# EAGLE design RPi-Breadboard_Bplus_v10 (EAGLE 7.5.0)
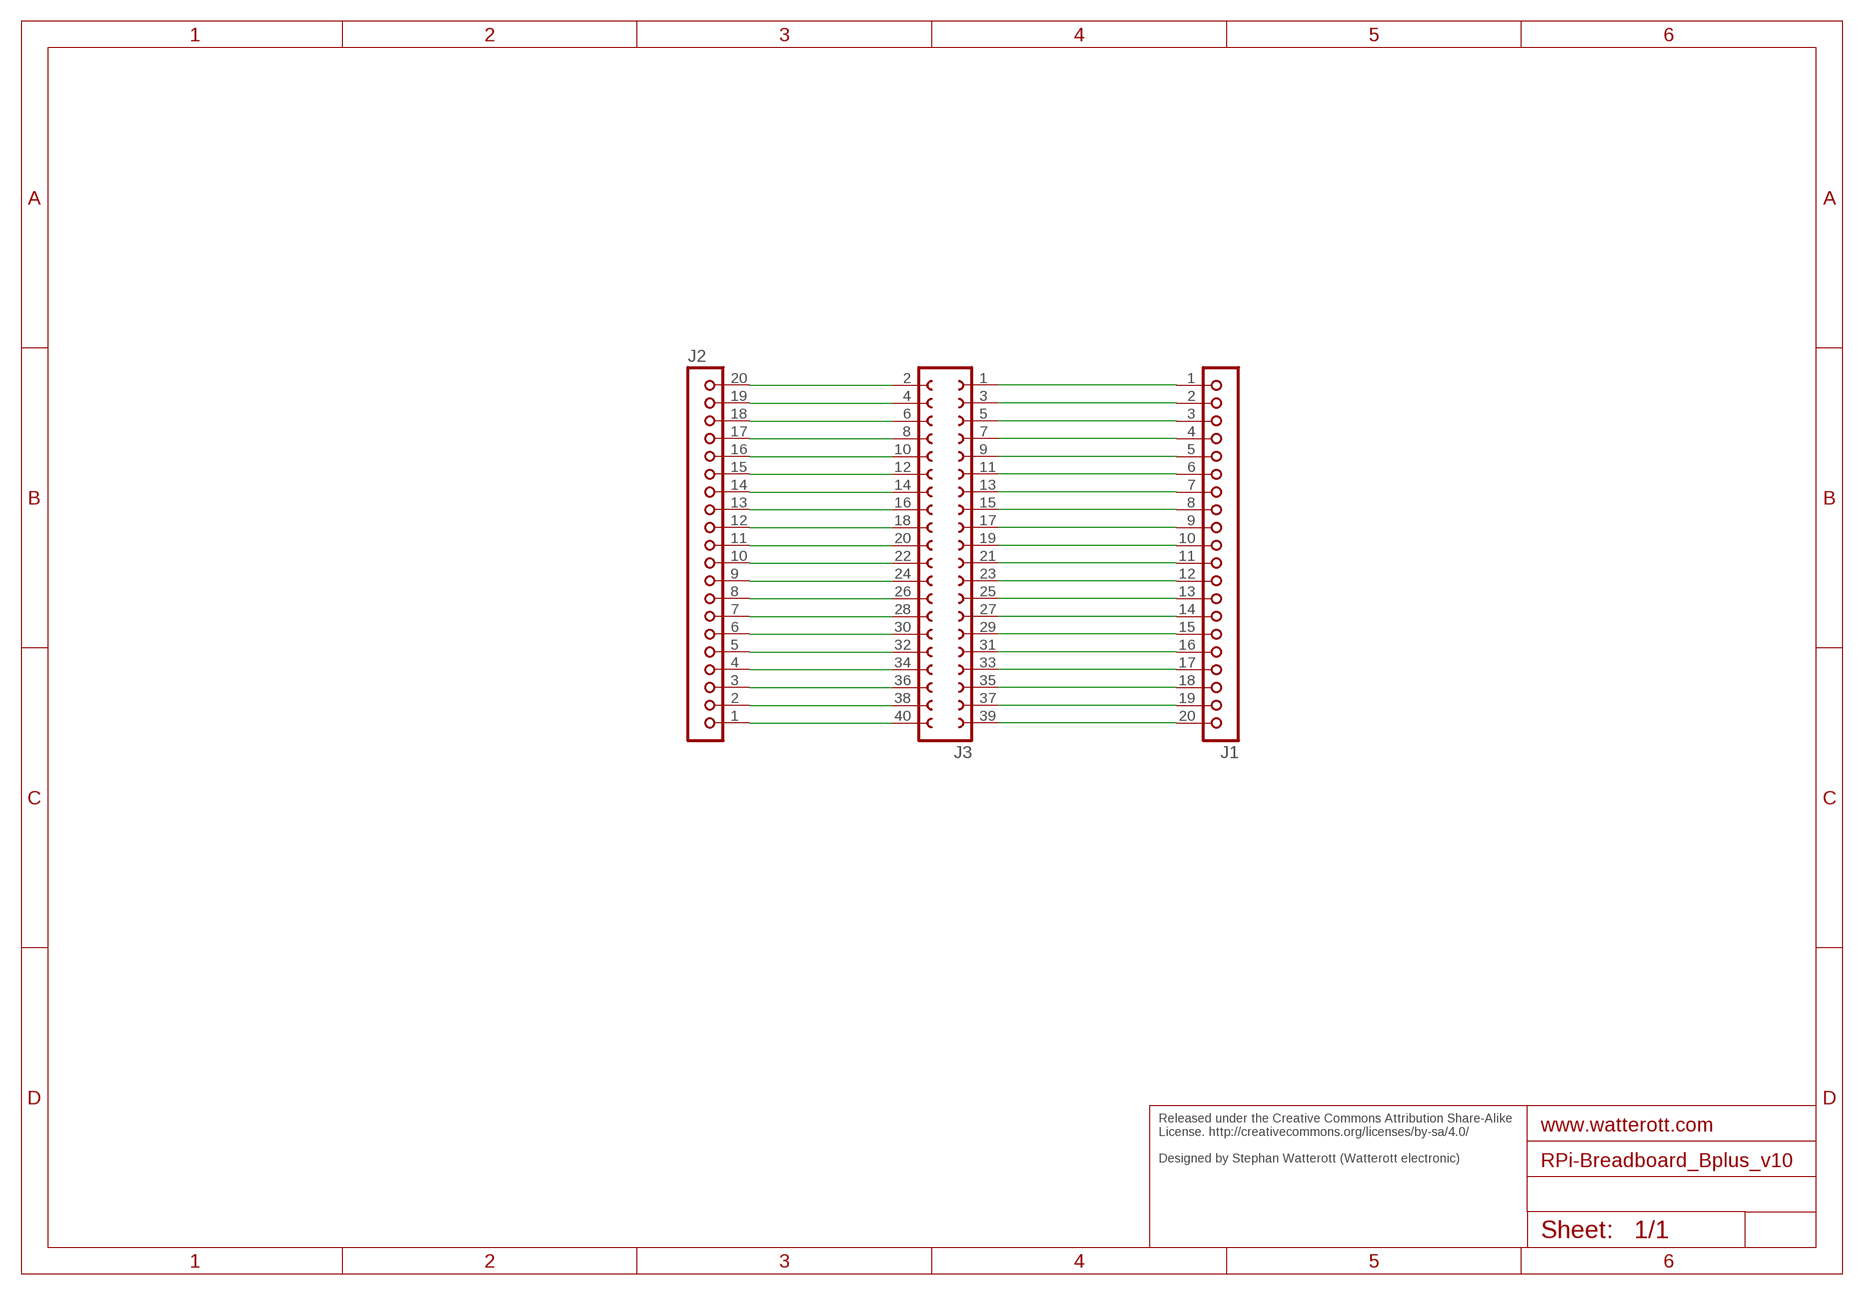
[diagram p0: schematic, sheet 1]

## Parts
J1  JBK20  [JBK20]
J2  JBK20  [JBK20]
J3  FE20-2  [FE20-2]

## Nets
5V: J1.1 J1.2 J3.1 J3.3
GND: J1.3 J1.7 J1.10 J1.15 J1.17 J2.1 J2.8 J2.16 J3.5 J3.10 J3.13 J3.19 J3.26 J3.29 J3.33 J3.40
N$6: J1.4 J3.7
N$9: J1.5 J3.9
N$12: J1.6 J3.11
N$14: J1.8 J3.15
N$15: J1.9 J3.17
N$17: J1.11 J3.21
N$18: J1.12 J3.23
N$19: J1.13 J3.25
N$20: J1.14 J3.27
N$22: J1.16 J3.31
N$24: J1.18 J3.35
N$25: J1.19 J3.37
N$26: J1.20 J3.39
N$28: J2.2 J3.38
N$29: J2.3 J3.36
N$30: J2.4 J3.34
N$31: J2.5 J3.32
N$32: J2.6 J3.30
N$33: J2.7 J3.28
N$35: J2.9 J3.24
N$36: J2.10 J3.22
N$37: J2.11 J3.20
N$38: J2.12 J3.18
N$39: J2.13 J3.16
N$40: J2.14 J3.14
N$41: J2.15 J3.12
N$43: J2.17 J3.8
N$44: J2.18 J3.6
N$45: J2.19 J3.4
N$46: J2.20 J3.2

## Notes on the sheet
- Released under the Creative Commons Attribution Share-Alike 
  License. http://creativecommons.org/licenses/by-sa/4.0/
  
  Designed by Stephan Watterott (Watterott electronic)

## Library data of the parts
J1 J2 = con-lsta:JBK20: PIN HEADER; OC_FARNELL: unknown; OC_NEWARK: unknown
J3 = con-lsta:FE20-2: FEMALE HEADER; OC_FARNELL: unknown; OC_NEWARK: unknown

## Board
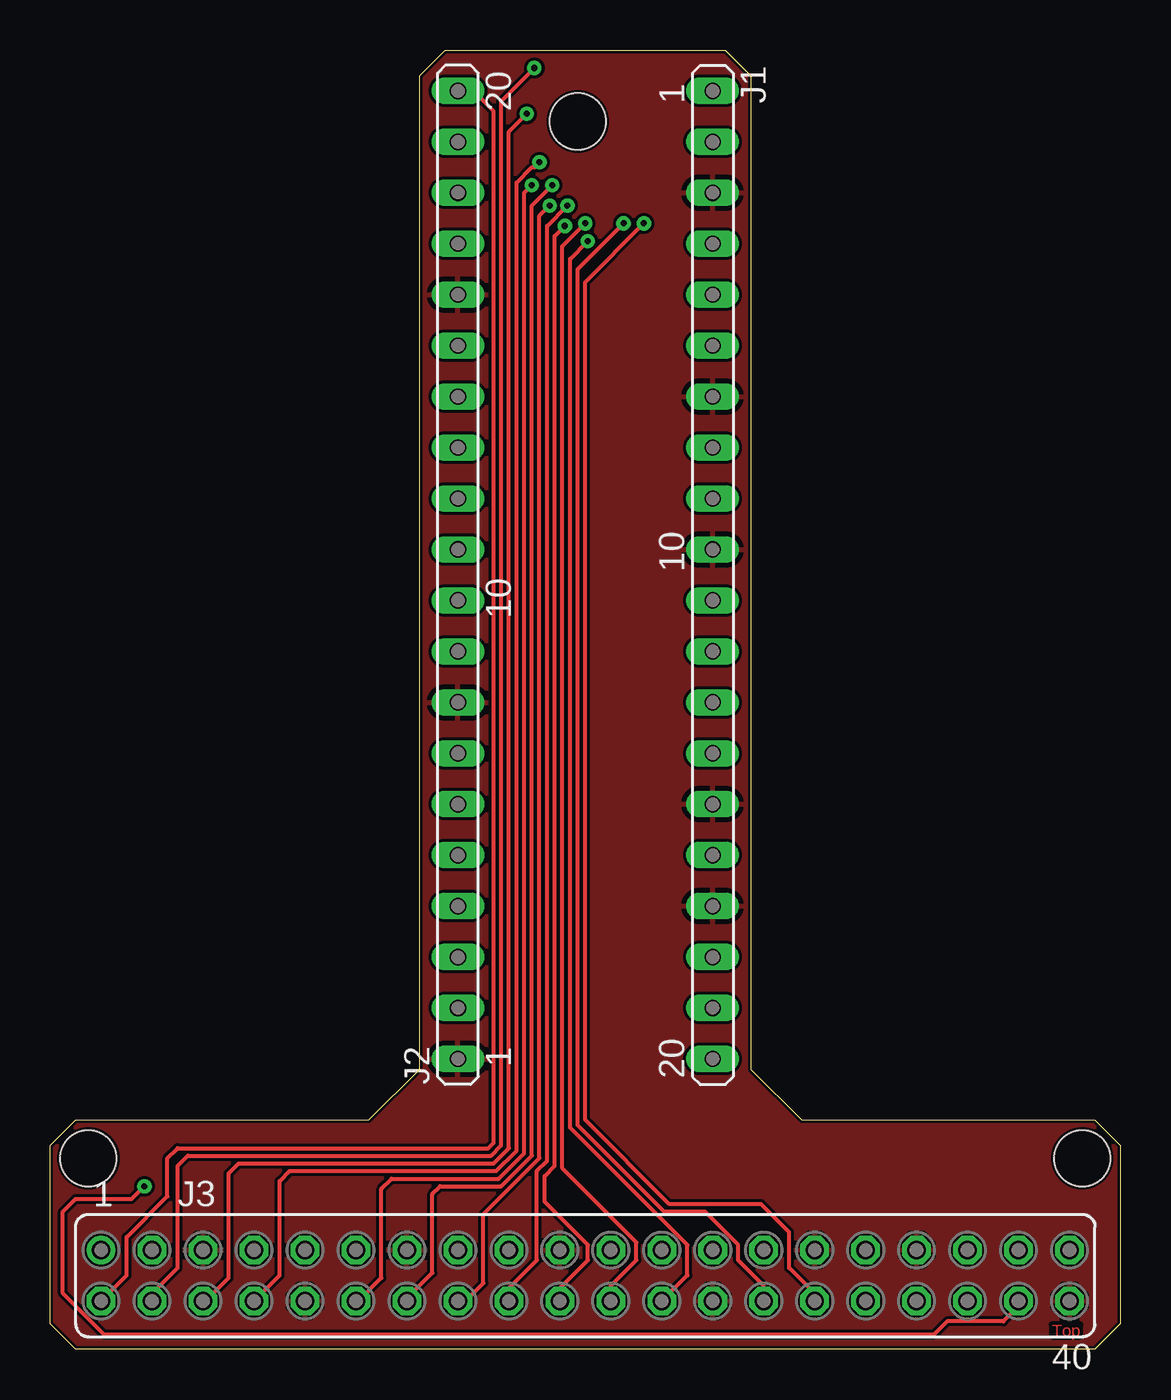
[diagram p1: board, top side]
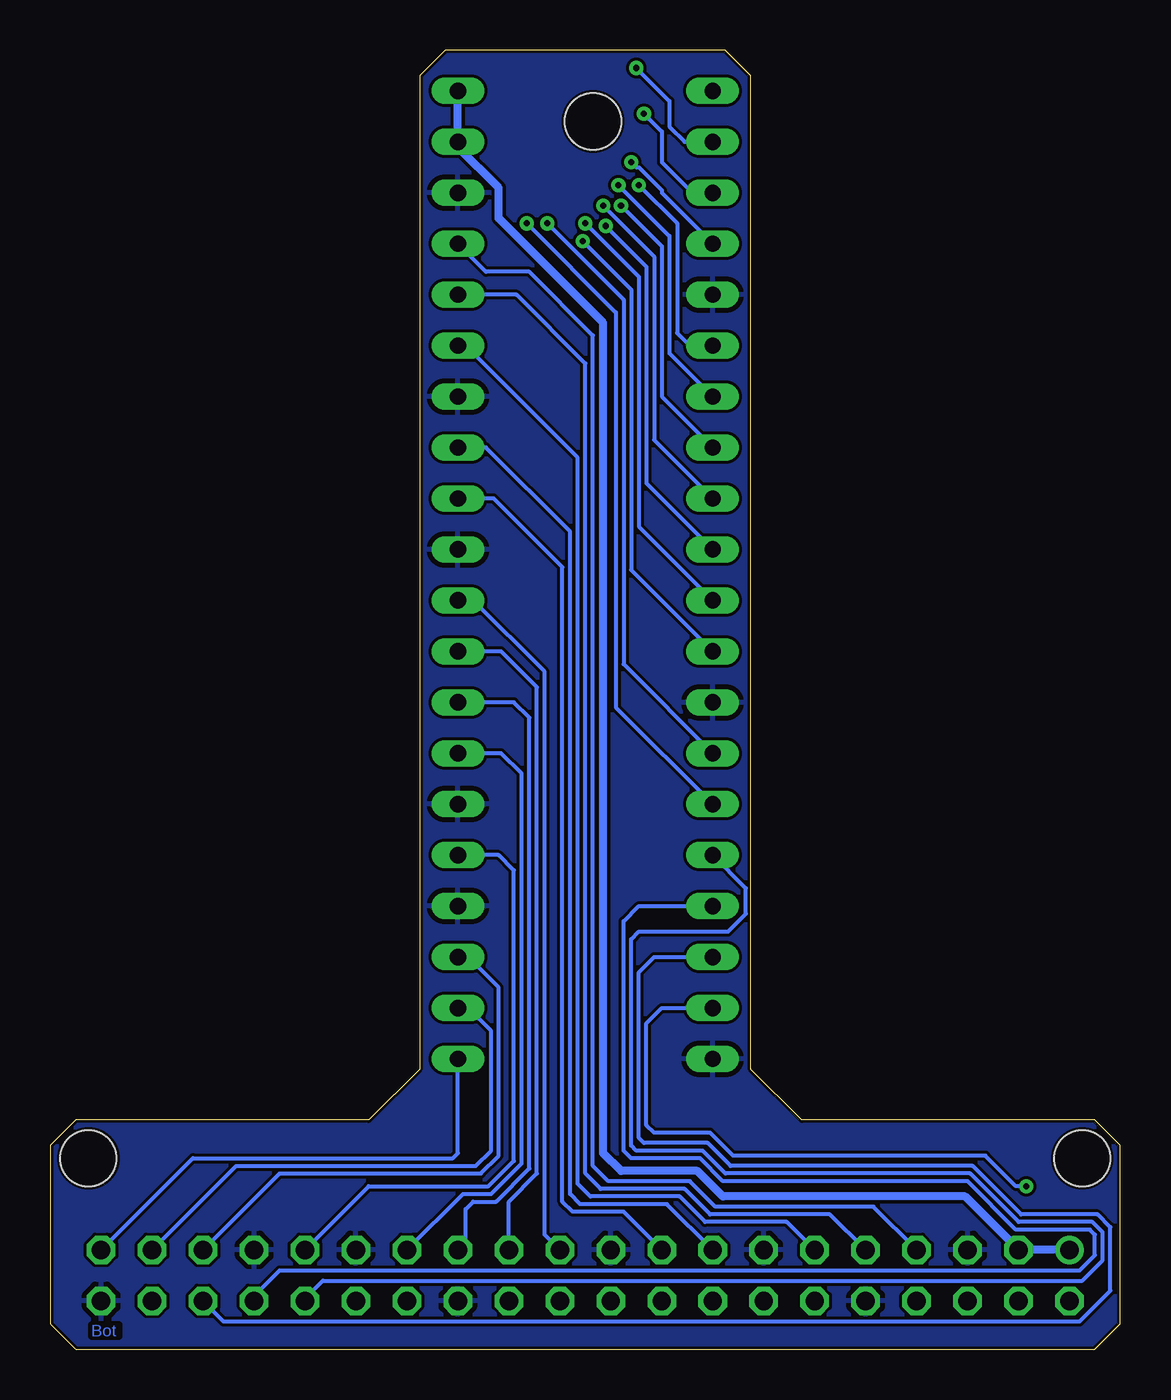
[diagram p2: board, bottom side, seen from below]

Size 53.34 x 64.77 mm. Coordinates in mm from the lower left corner, seen from the top.
Outline: 1.27,0 0,1.27 0,10.16 1.27,11.43 15.88,11.43 18.41,13.97 18.41,63.5 19.69,64.77 33.66,64.77 34.93,63.5 34.93,13.97 37.47,11.43 52.07,11.43 53.34,10.16 53.34,1.27 52.07,0 1.27,0
Copper layers (1*16): Top 0.035mm / dielectric 1.5mm / Bottom 0.035mm
Design rules "watterott *": minimum track width 6mil, minimum drill 0.29mm, track to track 6mil, track to pad 6mil, pad to pad 6mil, via to via 6mil, smd to smd 6mil, copper to edge 6mil, drill to drill 8mil, minimum pad ring 10mil, minimum via ring 8mil, stop-mask expansion 4mil, vias tented up to drill 0.9mm, thermal gap 10mil
Holes 2.8 mm at 51.44,9.53 1.91,9.53 26.29,61.21

### Footprints (pad centres in the part's own frame; a part is rotated, then mirrored left to right if it is on the bottom)
JBK20 = drill 0.813 long: 1 -24.13,0; 2 -21.59,0; 3 -19.05,0; 4 -16.51,0; 5 -13.97,0; 6 -11.43,0; 7 -8.89,0; 8 -6.35,0; 9 -3.81,0; 10 -1.27,0; 11 1.27,0; 12 3.81,0; 13 6.35,0; 14 8.89,0; 15 11.43,0; 16 13.97,0; 17 16.51,0; 18 19.05,0; 19 21.59,0; 20 24.13,0
FE20-2 = drill 0.914: 1 -24.13,1.27 | drill 0.914 octagon: 2 -24.13,-1.27; 3 -21.59,1.27; 4 -21.59,-1.27; 5 -19.05,1.27; 6 -19.05,-1.27; 7 -16.51,1.27; 8 -16.51,-1.27; 9 -13.97,1.27; 10 -13.97,-1.27; 11 -11.43,1.27; 12 -11.43,-1.27; 13 -8.89,1.27; 14 -8.89,-1.27; 15 -6.35,1.27; 16 -6.35,-1.27; 17 -3.81,1.27; 18 -3.81,-1.27; 19 -1.27,1.27; 20 -1.27,-1.27; 21 1.27,1.27; 22 1.27,-1.27; 23 3.81,1.27; 24 3.81,-1.27; 25 6.35,1.27; 26 6.35,-1.27; 27 8.89,1.27; 28 8.89,-1.27; 29 11.43,1.27; 30 11.43,-1.27; 31 13.97,1.27; 32 13.97,-1.27; 33 16.51,1.27; 34 16.51,-1.27; 35 19.05,1.27; 36 19.05,-1.27; 37 21.59,1.27; 38 21.59,-1.27; 39 24.13,1.27; 40 24.13,-1.27

### Placement (x,y rotation side)
J1  33.02,38.61 270 top
J2  20.32,38.61 90 top
J3  26.67,3.68 0 top

### Tracks (layer width: path | path; a pad name or v marks a point on that pad's centre or on a via)
5V
  Bottom 0.406: J3.1 J3.3 7.75,7.62 19.81,7.62 21.08,8.89 24.89,8.89 25.78,9.78 25.78,51.18 30.99,56.39 30.99,57.91 33.02,59.94 J1.2 J1.1
GND
  pour Top: 1.27,11.43 15.88,11.43 18.41,13.97 18.41,63.5 19.69,64.77 33.66,64.77 34.93,63.5 34.93,13.97 37.47,11.43 52.07,11.43 53.34,10.16 53.34,1.27 52.07,0 1.27,0 0,1.27 0,10.16
  pour Bottom: 1.27,11.43 15.88,11.43 18.41,13.97 18.41,63.5 19.69,64.77 33.66,64.77 34.93,63.5 34.93,13.97 37.47,11.43 52.07,11.43 53.34,10.16 53.34,1.27 52.07,0 1.27,0 0,1.27 0,10.16
N$6
  Bottom 0.2: J3.7 12.32,7.11 20.19,7.11 21.46,8.38 25.53,8.38 26.29,9.14 26.29,50.55 29.46,53.72 31.62,53.72 J1.4
N$9
  Bottom 0.2: J3.9 14.48,6.73 20.45,6.73 21.72,8 25.91,8 26.67,8.76 26.67,49.15 30.1,52.58 J1.5
N$12
  Bottom 0.2: J3.11 16.64,6.35 20.7,6.35 21.97,7.62 26.42,7.62 27.05,8.26 27.05,44.45 32.64,50.04 J1.6
N$14
  Bottom 0.2: J3.15 22.61,7.24 26.92,7.24 27.43,7.75 27.43,40.77 31.62,44.96 J1.8
N$15
  Bottom 0.2: J3.17 24.77,6.86 27.31,6.86 27.81,7.37 27.81,38.99 31.24,42.42 J1.9
N$17
  Bottom 0.2: J3.21 28.7,5.71 28.7,33.78 32.26,37.34 J1.11
N$18
  Bottom 0.2: J3.23 30.48,7.37 29.08,8.76 29.08,33.02 30.86,34.8 J1.12
N$19
  Bottom 0.2: J3.25 32.64,5.33 32.64,6.98 32.26,7.37 31.12,7.37 29.46,9.02 29.46,31.5 30.23,32.26 J1.13
N$20
  Bottom 0.2: J3.27 32.77,7.75 31.37,7.75 29.85,9.27 29.85,28.7 30.86,29.72 J1.14
N$22
  Bottom 0.2: J3.31 37.47,8.13 31.5,8.13 30.23,9.4 30.23,23.88 30.99,24.64 J1.16
N$24
  Bottom 0.2: J3.35 41.91,8.76 31.88,8.76 30.99,9.65 30.99,18.03 32.51,19.56 J1.18
N$25
  Bottom 0.2: J3.37 44.07,9.14 32.13,9.14 31.37,9.91 31.37,15.88 32.51,17.02 J1.19
N$26
  Bottom 0.2: J3.39 46.23,9.53 33.27,9.53 33.02,9.78 J1.20
N$28  (via drill 0.3)
  Top 0.2: J3.38 48.39,2.29 47.5,1.4 44.7,1.4 44.07,0.76 2.67,0.76 0.64,2.79 0.64,6.86 1.27,7.49 4.06,7.49 v4.7,8.13
  Bottom 0.2: J2.2 22.86,17.02 23.62,16.26 23.62,11.18 23.24,10.79 20.45,10.79 19.3,9.65 6.73,9.65 5.21,8.13 v4.7,8.13
N$29
  Bottom 0.2: J3.36 44.7,1.4 2.03,1.4 0.51,2.92 0.51,6.1 1.14,6.73 4.95,6.73 7.37,9.14 19.43,9.14 20.57,10.29 23.75,10.29 24,10.54 24,18.8 23.24,19.56 J2.3
N$30
  Bottom 0.2: J3.34 43.18,2.67 41.91,3.94 2.03,3.94 1.27,4.7 1.27,5.71 1.52,5.97 5.21,5.97 7.62,8.38 19.81,8.38 20.96,9.53 24.38,9.53 24.77,9.91 24.77,21.34 24,22.1 J2.4
N$31
  Bottom 0.2: J3.32 40.64,2.54 39.75,3.43 1.91,3.43 0.89,4.45 0.89,5.84 1.4,6.35 5.08,6.35 7.49,8.76 19.69,8.76 20.83,9.91 24.13,9.91 24.38,10.16 24.38,20.45 24,20.83 19.56,20.83 18.67,21.72 18.67,22.99 J2.5
N$32  (via drill 0.3 pad 0.61)
  Top 0.2: J3.30 38.1,2.79 36.83,4.06 36.83,5.84 35.43,7.24 30.86,7.24 26.67,11.43 26.67,53.21 v29.59,56.13
  Bottom 0.2: v29.59,56.13 25.15,51.69 25.15,32 J2.6
N$33  (via drill 0.3 pad 0.61)
  Top 0.2: J3.28 35.56,3.17 34.29,4.45 34.29,5.21 32.64,6.86 30.61,6.86 26.29,11.18 26.29,53.85 v28.58,56.13
  Bottom 0.2: v28.58,56.13 24.77,52.32 24.77,34.16 J2.7
N$35  (via drill 0.3 pad 0.61)
  Top 0.2: J3.24 31.75,3.68 31.75,5.21 25.91,11.05 25.91,54.36 v26.8,55.25
  Bottom 0.2: v26.8,55.25 24.38,52.83 24.38,38.86 J2.9
N$36  (via drill 0.3 pad 0.61)
  Top 0.2: J3.22 27.94,3.17 29.21,4.45 29.21,5.33 25.53,9.02 25.53,54.99 v26.67,56.13
  Bottom 0.2: v26.67,56.13 24,53.47 24,41.02 J2.10
N$37  (via drill 0.3 pad 0.61)
  Top 0.2: J3.20 25.4,3.05 26.8,4.45 26.8,5.21 24.64,7.37 24.64,8.64 25.15,9.14 25.15,55.5 v25.65,56.01
  Bottom 0.2: v25.65,56.01 23.62,53.98 23.62,43.18 J2.11
N$38  (via drill 0.3 pad 0.61)
  Top 0.2: J3.18 22.86,3.05 24.26,4.45 24.26,8.89 24.77,9.4 24.77,56.01 v25.78,57.02
  Bottom 0.2: v25.78,57.02 23.24,54.48 23.24,45.34 J2.12
N$39  (via drill 0.3 pad 0.61)
  Top 0.2: J3.16 20.7,2.41 21.59,3.3 21.59,6.73 24.38,9.53 24.38,56.52 v24.89,57.02
  Bottom 0.2: v24.89,57.02 22.86,54.99 22.86,47.5 J2.13
N$40  (via drill 0.3 pad 0.61)
  Top 0.2: J3.14 17.78,2.54 19.05,3.81 19.05,7.75 19.43,8.13 22.48,8.13 24,9.65 24,57.02 v25.02,58.04
  Bottom 0.2: v25.02,58.04 22.48,55.5 22.48,49.66 J2.14
N$41  (via drill 0.3 pad 0.61)
  Top 0.2: J3.12 15.37,2.41 16.51,3.56 16.51,8 17.02,8.51 22.35,8.51 23.62,9.78 23.62,57.66 v24,58.04
  Bottom 0.2: v24,58.04 22.1,56.13 22.1,50.67 21.46,50.04 J2.15
N$43  (via drill 0.3 pad 0.61)
  Top 0.2: J3.8 11.43,3.68 11.43,8.38 11.94,8.89 22.23,8.89 23.24,9.91 23.24,58.04 23.24,58.17 24,58.93 24.13,58.93 v24.38,59.18
  Bottom 0.2: v24.38,59.18 24.13,58.93 24,58.93 22.86,57.79 22.86,57.66 J2.17
N$44  (via drill 0.3 pad 0.61)
  Top 0.2: J3.6 7.75,2.41 8.89,3.56 8.89,8.76 9.4,9.27 22.1,9.27 22.86,10.03 22.86,60.71 v23.75,61.59
  Bottom 0.2: v23.75,61.59 22.86,60.71 22.86,59.18 21.34,57.66 J2.18
N$45  (via drill 0.3 pad 0.61)
  Top 0.2: J3.4 5.08,2.79 6.35,4.06 6.35,9.14 6.86,9.65 21.97,9.65 22.48,10.16 22.48,62.23 v24.13,63.88
  Bottom 0.2: v24.13,63.88 22.48,62.23 22.48,60.96 21.72,60.2 J2.19
N$46
  Top 0.2: J3.2 3.81,3.68 3.81,5.59 5.84,7.62 5.84,9.53 6.35,10.03 21.84,10.03 22.1,10.29 22.1,61.72 21.08,62.74 J2.20

### Text on the board
Top: Top
Bottom: Bot
tValues: 5V | 3V3 | 5V | IO2 | GND | IO3 | IO14 | IO4 | IO15 | GND | IO18 | IO17 | GND | IO27 | IO23 | IO22 | IO24 | 3V3 | GND | IO10 | IO25 | IO9 | IO8 | IO11 | IO7 | GND | ID.SC | ID.SD | GND | IO5 | IO12 | IO6 | GND | IO13 | IO16 | IO19 | IO20 | IO26 | IO21 | GND | Raspberry Model B+ / Breadboard Adapter | www.watterott.com | Open / Hardware | Pin 1
Reference: Silkscreen: 27 tValues